# EAGLE design Esp8266_prot16_v1 (EAGLE 8.4.0)
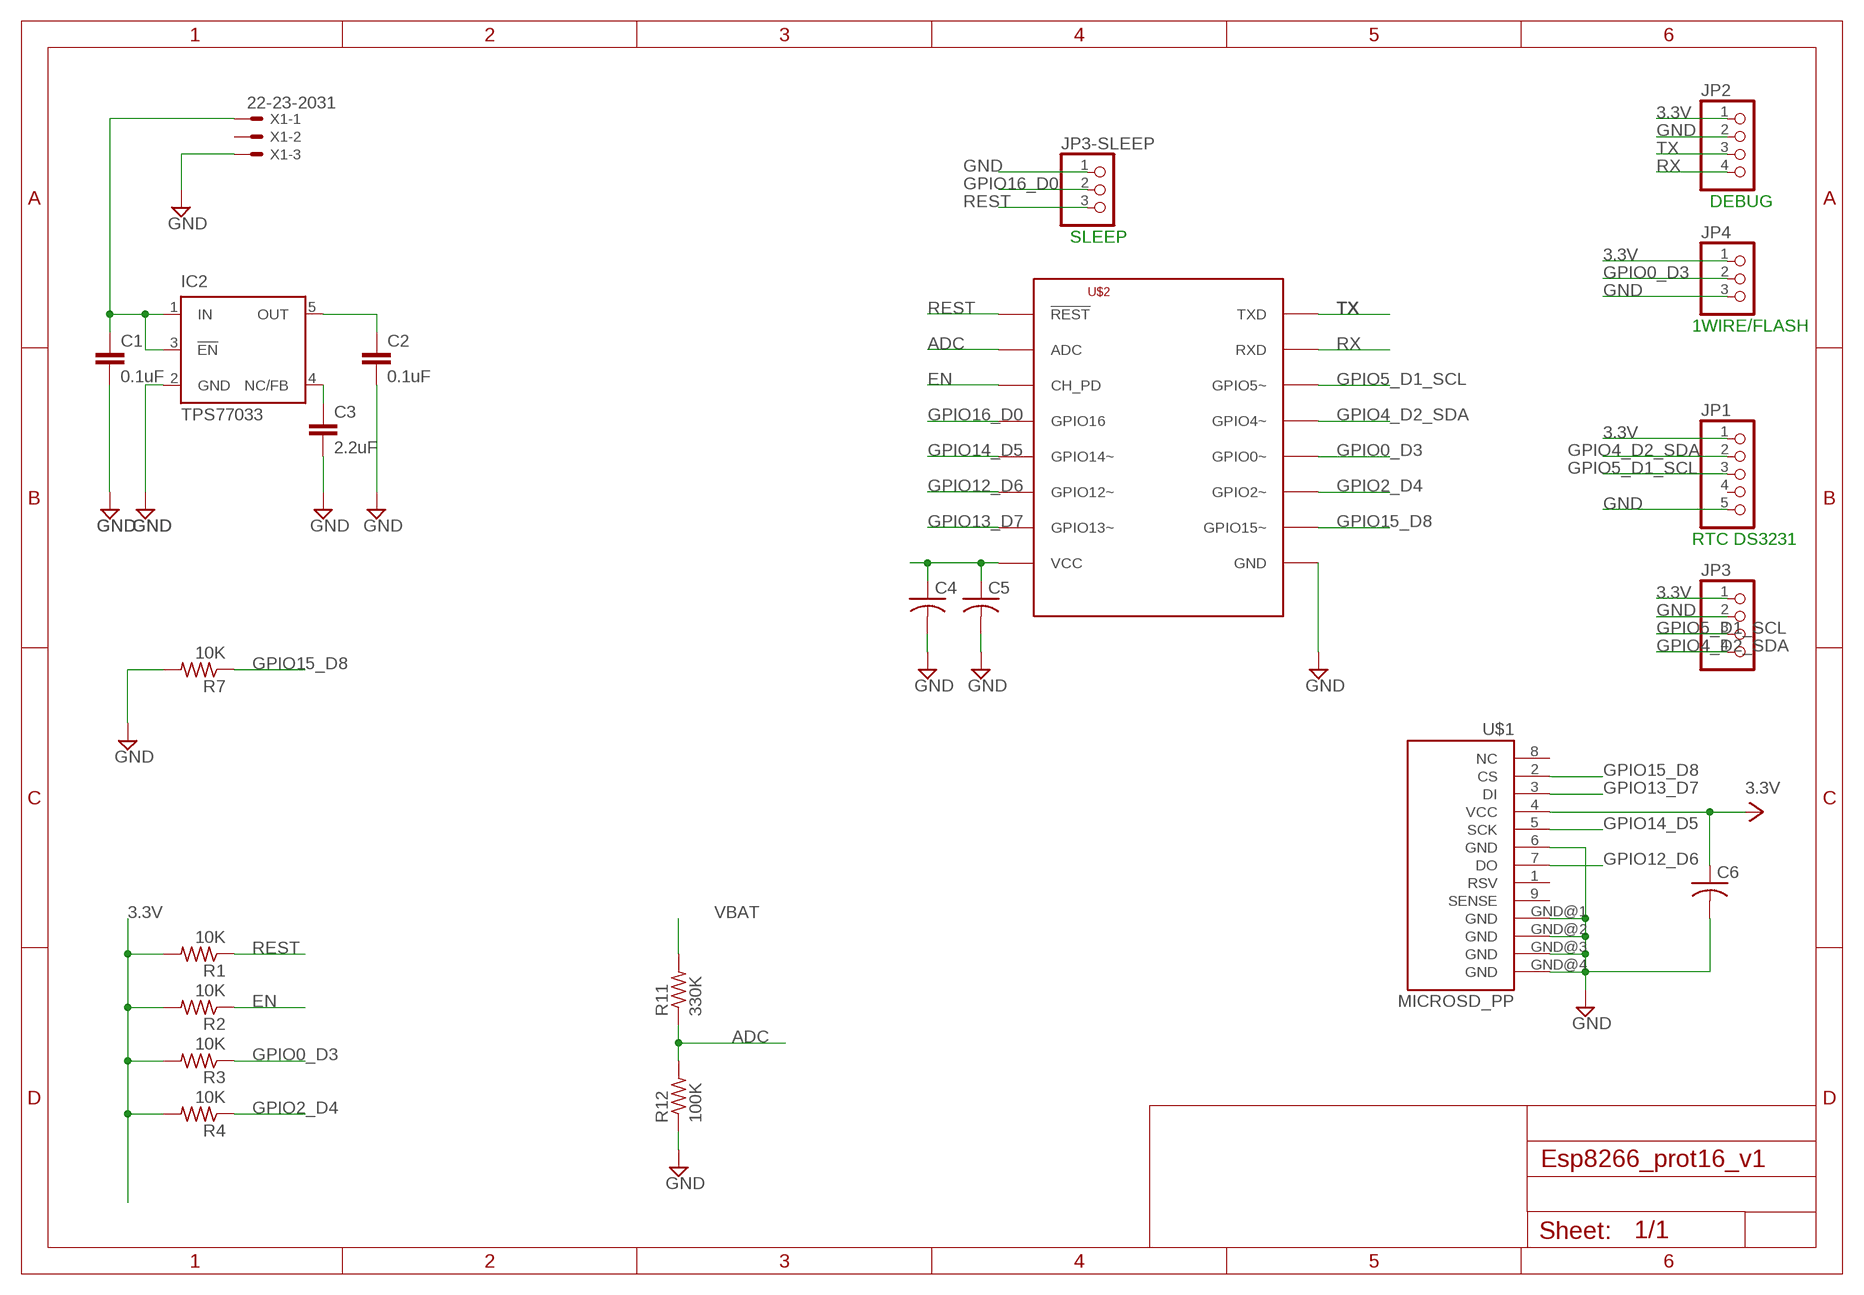
[diagram p0: schematic, sheet 1]

## Parts
C1  0.1uF  C-EUC0805  [C0805]
C2  0.1uF  C-EUC0805  [C0805]
C3  2.2uF  C-EUC0805  [C0805]
C4  C-USC1206  [C1206]
C5  C-USC0805K  [C0805K]
C6  C-USC1206  [C1206]
IC2  TPS77033  [SOT23-DBV]
JP1  PINHD-1X5  [1X05]
JP2  PINHD-1X4  [1X04]
JP3  PINHD-1X4  [1X04]
JP3-SLEEP  PINHD-1X3  [1X03]
JP4  PINHD-1X3  [1X03]
R1  10K  R-US_M0805  [M0805]
R2  10K  R-US_M0805  [M0805]
R3  10K  R-US_M0805  [M0805]
R4  10K  R-US_R0805  [R0805]
R7  10K  R-US_R0805  [R0805]
R11  330K  R-US_R0805  [R0805]
R12  100K  R-US_R0805  [R0805]
U$1  MICROSD_PP  [MICROSD_PP]
U$2  ESP8266-07  [ESP-07]
X1  22-23-2031  [22-23-2031]

## Nets
3.3V: C2.1 C4.1 C5.1 C6.1 IC2.5(OUT) JP1.1 JP2.1 JP3.1 JP4.1 R1.2 R2.2 R3.2 R4.2 U$1.4(VCC) U$2.VCC
ADC: R11.1 R12.2 U$2.ADC
BYPASS: C3.1 IC2.4(NC/FB)
EN: R2.1 U$2.CH_PD
GND: C1.2 C2.2 C3.2 C4.2 C5.2 C6.2 IC2.2(GND) JP1.5 JP2.2 JP3-SLEEP.1 JP3.2 JP4.3 R7.2 R12.1 U$1.6(GND) U$1.GND@1(GND) U$1.GND@2(GND) U$1.GND@3(GND) U$1.GND@4(GND) U$2.GND X1.3
GPIO0_D3: JP4.2 R3.1 U$2.GPIO0(GPIO0~)
GPIO2_D4: R4.1 U$2.GPIO2(GPIO2~)
GPIO4_D2_SDA: JP1.2 JP3.4 U$2.GPIO5(GPIO4~)
GPIO5_D1_SCL: JP1.3 JP3.3 U$2.GPIO4(GPIO5~)
GPIO12_D6: U$1.7(DO) U$2.GPIO12(GPIO12~)
GPIO13_D7: U$1.3(DI) U$2.GPIO13(GPIO13~)
GPIO14_D5: U$1.5(SCK) U$2.GPIO14(GPIO14~)
GPIO15_D8: R7.1 U$1.2(CS) U$2.GPIO15(GPIO15~)
GPIO16_D0: JP3-SLEEP.2 U$2.GPIO16
REST: JP3-SLEEP.3 R1.1 U$2.REST(!REST)
RX: JP2.4 U$2.RXD
TX: JP2.3 U$2.TXD
VBAT: C1.1 IC2.1(IN) IC2.3(!EN) R11.2 X1.1
Unconnected: JP1.4 U$1.1(RSV) U$1.8(NC) U$1.9(SENSE) X1.2

## Notes on the sheet
- DEBUG
- SLEEP
- 1WIRE/FLASH
- RTC DS3231

## Library data of the parts
C1-C3 = rcl:C-EU: CAPACITOR, European symbol
C4-C6 = adafruit:C-US: CAPACITOR, American symbol
IC2 = texas:TPS770*: ULTRALOW-POWER 50-mA LOW-DROPOUT LINEAR REGULATORS 50-mA Low-Dropout Regulator Source: http://focus.ti.com/lit/ds/symlink/tps77001.pdf; MF: TEXAS INSTRUMENTS; MPN: TPS79301; OC_FARNELL: 8461570; OC_NEWARK: 77C1187
JP1 = pinhead:PINHD-1X5: PIN HEADER
JP2 JP3 = pinhead:PINHD-1X4: PIN HEADER
JP3-SLEEP JP4 = pinhead:PINHD-1X3: PIN HEADER
R1-R4 R7 R11 R12 = adafruit:R-US_: RESISTOR, American symbol
U$1 = DE1594-v2:MICROSD_PP
U$2 = lio:ESP8266
X1 = con-molex:22-23-2031: .100" (2.54mm) Center Header - 3 Pin; MF: MOLEX; MPN: 22-23-2031; OC_FARNELL: 1462950; OC_NEWARK: 30C0862

## Board
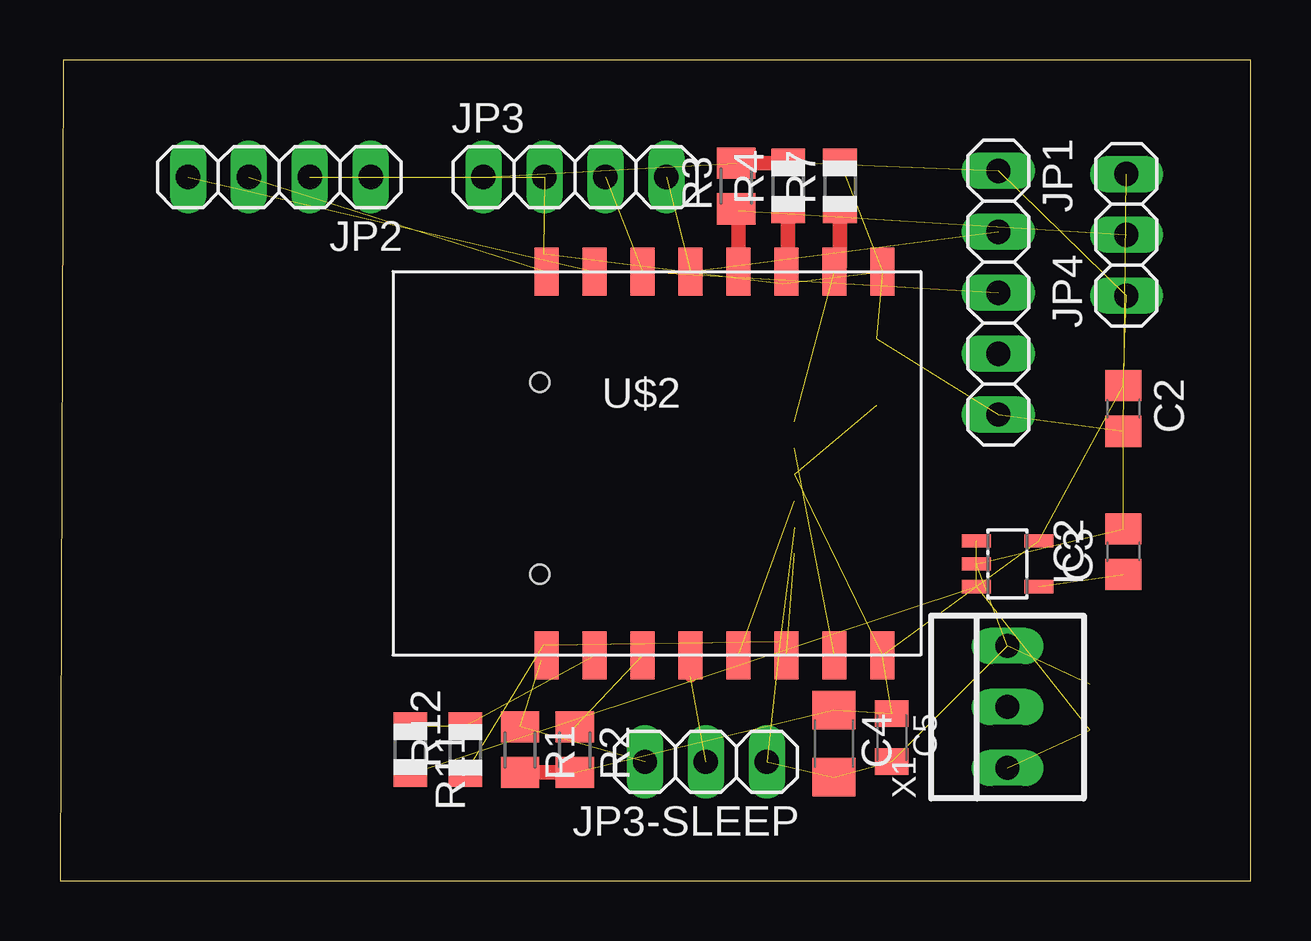
[diagram p1: board, top side]
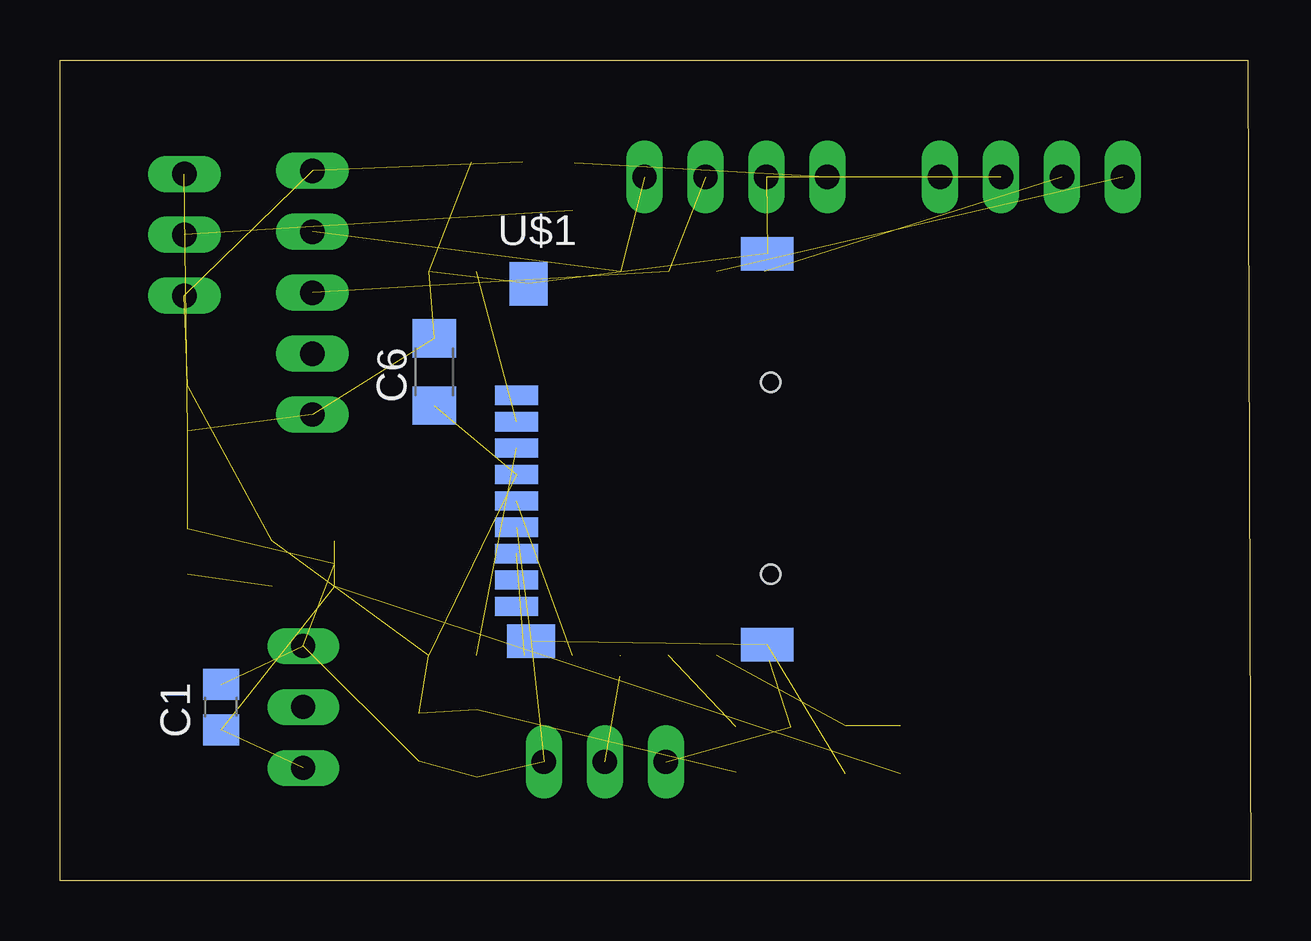
[diagram p2: board, bottom side, seen from below]

Size 49.64 x 34.21 mm. Coordinates in mm from the lower left corner, seen from the top.
Outline: 0,0 49.64,0 49.64,34.21 0.13,34.21 0,0
Copper layers (1*16): Top 0.035mm / dielectric 1.5mm / Bottom 0.035mm
Design rules "default *": minimum track width 12mil, minimum drill 0.55mm, track to track 12mil, track to pad 12mil, pad to pad 6mil, via to via 6mil, smd to smd 6mil, copper to edge 80mil, drill to drill 6mil, minimum pad ring 10mil, minimum via ring 8mil, stop-mask expansion 4mil, vias tented up to drill 0mil, thermal gap 10mil

### Footprints (pad centres in the part's own frame; a part is rotated, then mirrored left to right if it is on the bottom)
C0805 = smd 1.3 x 1.5: 1 -0.95,0; 2 0.95,0
C1206 = smd 1.6 x 1.8: 1 -1.4,0; 2 1.4,0
C0805K = smd 1.1 x 1.4: 1 -1,0; 2 1,0
SOT23-DBV = smd 0.55 x 1.2: 1 -0.95,-1.3; 2 0,-1.3; 3 0.95,-1.3; 4 0.95,1.3; 5 -0.95,1.3
1X05 = drill 1.016 long: 1 -5.08,0; 2 -2.54,0; 3 0,0; 4 2.54,0; 5 5.08,0
1X04 = drill 1.016 long: 1 -3.81,0; 2 -1.27,0; 3 1.27,0; 4 3.81,0
1X03 = drill 1.016 long: 1 -2.54,0; 2 0,0; 3 2.54,0
M0805 = smd 1.3 x 1.6: 1 -0.95,0; 2 0.95,0
R0805 = smd 1.1 x 1.4: 1 -1,0; 2 1,0
MICROSD_PP = smd 1.8 x 0.8: 1 0,3.85; 2 0,2.75; 3 0,1.65; 4 0,0.55; 5 0,-0.55; 6 0,-1.65; 7 0,-2.75; 8 0,-3.85; 9 0,-4.95 | smd 1.6 x 1.8: GND@1 0.5,8.5 | smd 2.2 x 1.4: GND@2 10.45,9.75; GND@4 10.45,-6.55 | smd 2 x 1.4: GND@3 0.6,-6.4 | hole 0.8: 10.6,4.4; 10.6,-3.6
ESP-07 = smd 1 x 2: ADC -1.6,-8; CH_PD 0.4,-8; GND 10.4,8; GPIO0 4.4,8; GPIO2 6.4,8; GPIO4 0.4,8; GPIO5 2.4,8; GPIO12 6.4,-8; GPIO13 8.4,-8; GPIO14 4.4,-8; GPIO15 8.4,8; GPIO16 2.4,-8; REST -3.6,-8; RXD -1.6,8; TXD -3.6,8; VCC 10.4,-8
22-23-2031 = drill 1 long: 1 -2.54,0; 2 0,0; 3 2.54,0

### Placement (x,y rotation side)
C1  42.93,7.24 90 bottom
C2  44.32,19.69 270 top
C3  44.32,13.72 90 top
C4  32.26,5.72 270 top
C5  34.67,5.97 270 top
C6  34.04,21.21 90 bottom
IC2  39.5,13.21 270 top
JP1  39.12,24.51 270 top
JP2  9.14,29.34 180 top
JP3  21.46,29.34 0 top
JP3-SLEEP  26.92,4.95 180 top
JP4  44.45,26.92 90 top
R1  19.18,5.46 270 top
R2  21.46,5.46 270 top
R3  28.19,28.96 90 top
R4  30.35,28.96 90 top
R7  32.51,28.96 90 top
R11  14.6,5.46 270 top
R12  16.89,5.46 90 top
U$1  30.61,16.38 0 bottom
U$2  23.88,17.4 0 top
X1  39.5,7.24 90 top

### Tracks (layer width: path | path; a pad name or v marks a point on that pad's centre or on a via)
3.3V  (12 unrouted)
  Top 0.61: R1.2 R2.2 | 28.5,30.08 R3.2 30.3,29.91 R4.2
ADC  (2 unrouted)
BYPASS  (1 unrouted)
EN  (1 unrouted)
GND  (20 unrouted)
GPIO0_D3  (1 unrouted)
  Top 0.61: R3.1 28.28,27.92 U$2.GPIO0
GPIO2_D4
  Top 0.61: R4.1 30.35,25.48 U$2.GPIO2
GPIO4_D2_SDA  (2 unrouted)
GPIO5_D1_SCL  (2 unrouted)
GPIO12_D6  (1 unrouted)
GPIO13_D7  (1 unrouted)
GPIO14_D5  (1 unrouted)
GPIO15_D8  (1 unrouted)
  Top 0.61: U$2.GPIO15 32.51,25.64 R7.1
GPIO16_D0  (2 unrouted)
  Top 0.508: 26.29,8.51 26.29,9.4
  Top 0.61: U$2.GPIO16 26.42,9.26
REST  (2 unrouted)
  Top 0.61: 20.07,9.19 U$2.REST
RX  (1 unrouted)
TX  (1 unrouted)
VBAT  (4 unrouted)